# Altium schematic sheet USB_DockingSTN.SchDoc
size A3; Organization: Altium Limited; Address1: L3, 12a Rodborough Rd; Address2: Frenchs Forest; Address3: NSW; Address4: Australia 2086
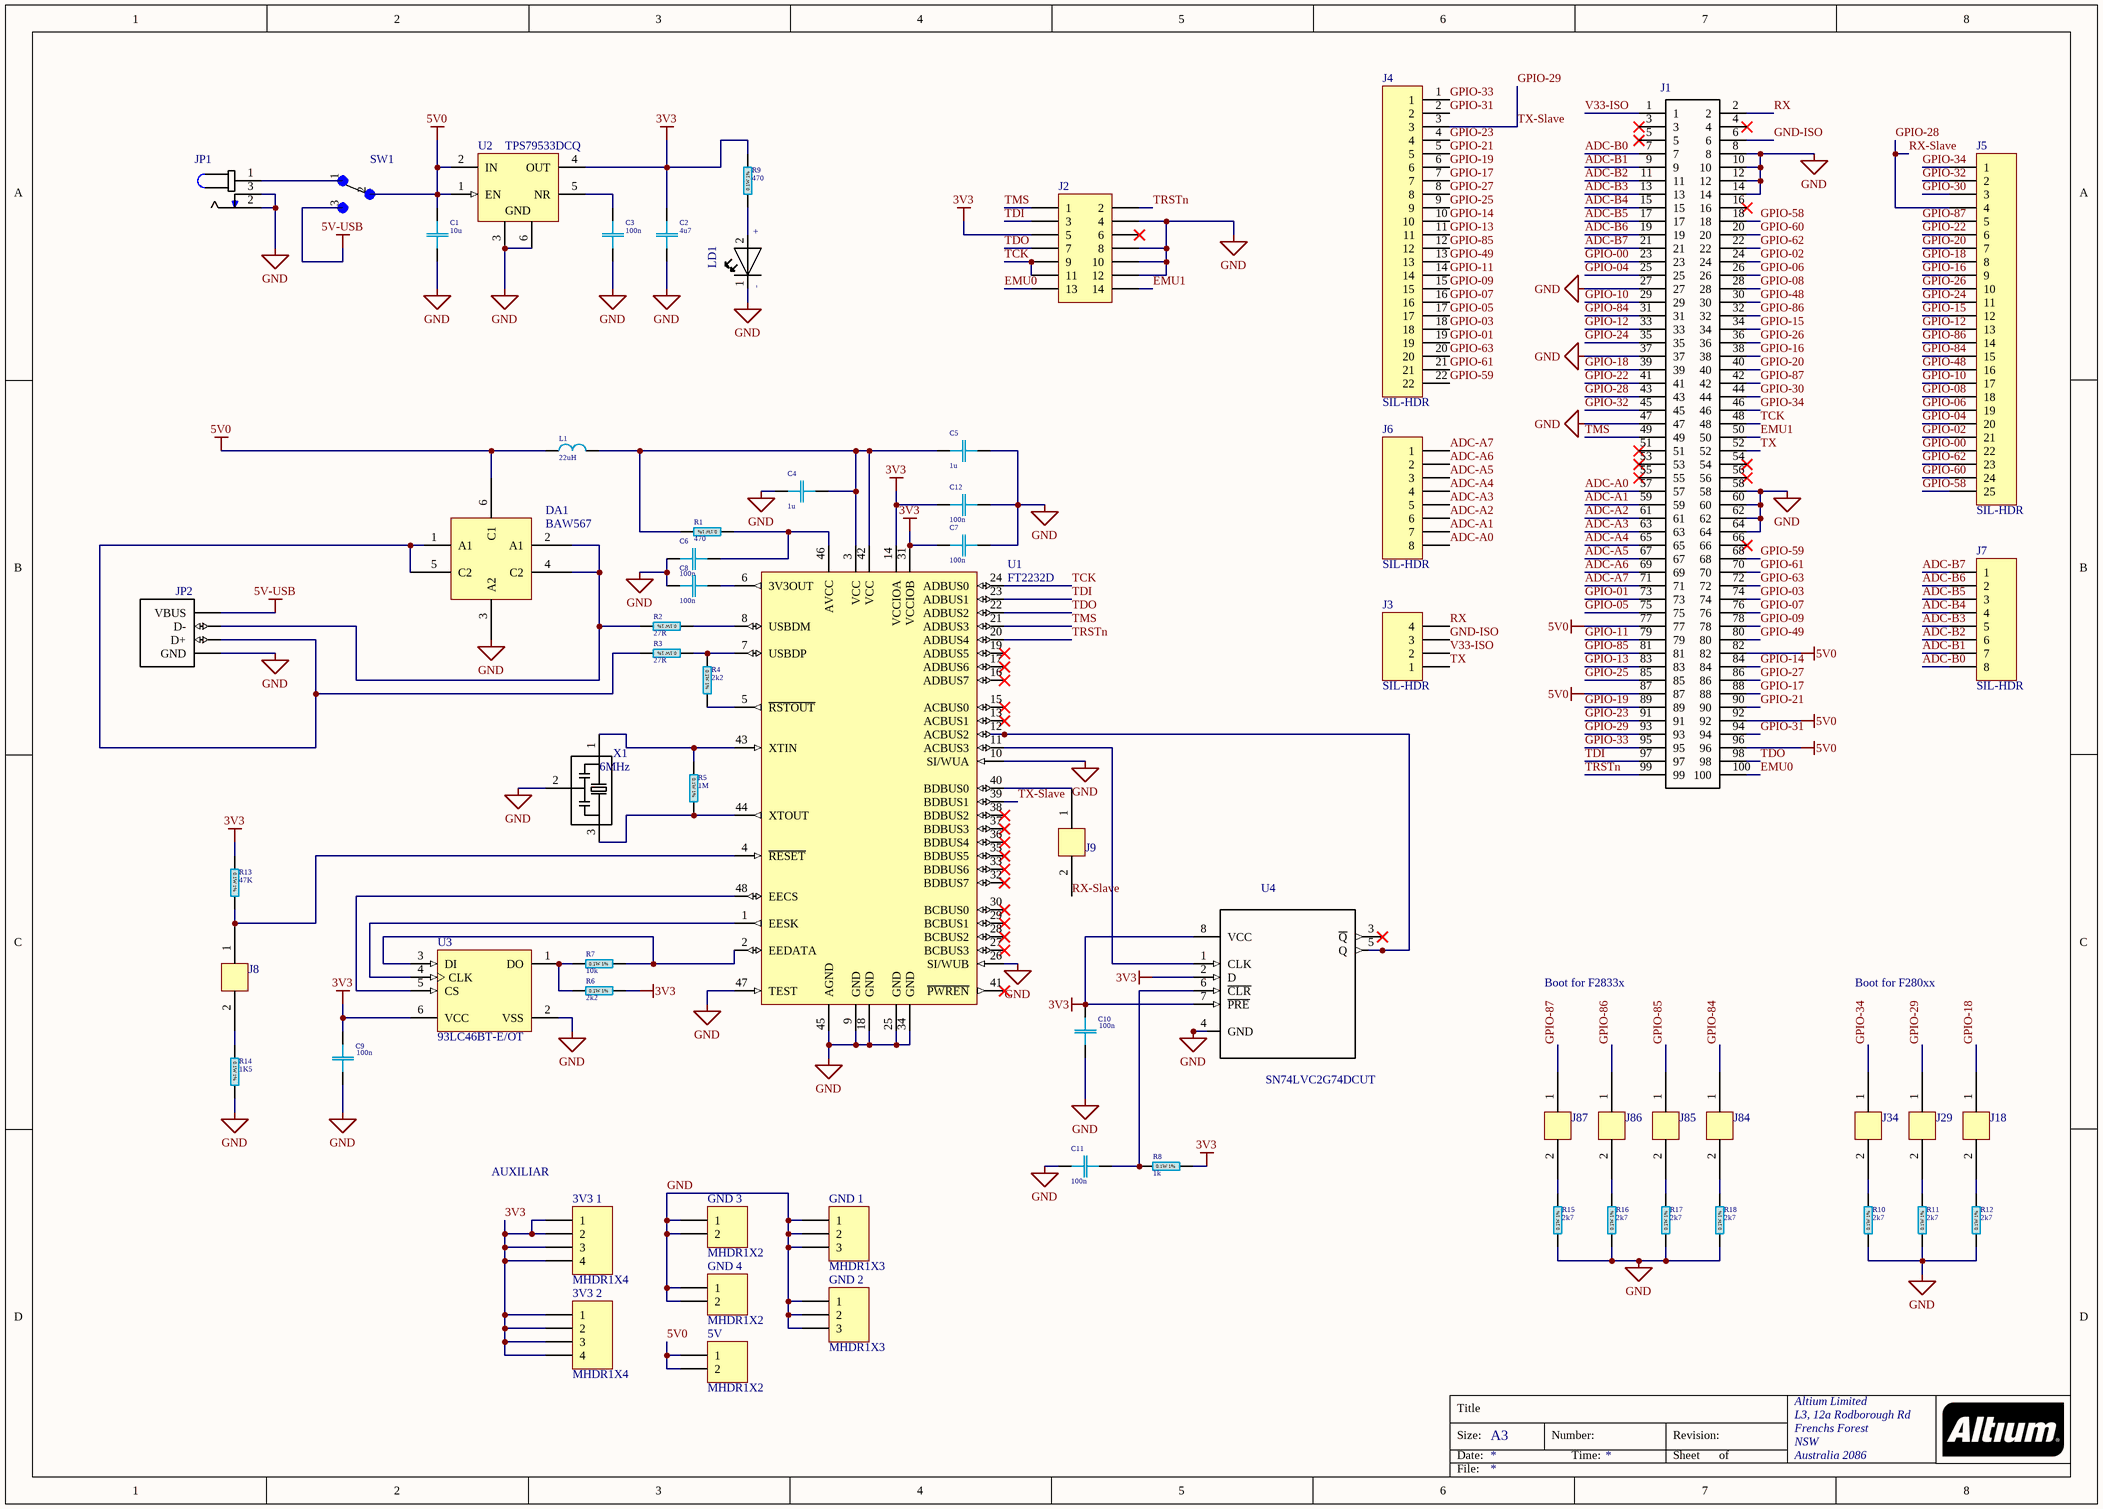
[diagram p0: USB_DockingSTN.SchDoc]

## Parts
3V3_1  MHDR1X4  [MHDR1X4]
3V3_2  MHDR1X4  [MHDR1X4]
5V  MHDR1X2  [MHDR1X2]
C1  10u  [C 0805(2012)x0.65]
C2  0n: 4u7  [C 0805(2012)x0.65]
C3  0n: 100n  [C 0805(2012)x0.65]
C4  1u  [C 0603(1608)x0.8]
C5  1u  [C 0603(1608)x0.8]
C6  100n  [C 0603(1608)x0.8]
C7  100n  [C 0603(1608)x0.8]
C8  100n  [C 0603(1608)x0.8]
C9  100n  [C 0603(1608)x0.8]
C10  100n  [C 0603(1608)x0.8]
C11  100n  [C 0603(1608)x0.8]
C12  100n  [C 0603(1608)x0.8]
DA1  BAW567  [BAW567]
GND_1  MHDR1X3  [MHDR1X3]
GND_2  MHDR1X3  [MHDR1X3]
GND_3  MHDR1X2  [MHDR1X2]
GND_4  MHDR1X2  [MHDR1X2]
J1  5390213-1  [*TE_5390213-1]  (value not drawn)
J2  MHDR2X7  [MHDR2X7]  (value not drawn)
J3  SIL-HDR  [MHDR1X4]
J4  SIL-HDR  [PIN22]
J5  SIL-HDR  [HDR1X25]
J6  SIL-HDR  [MHDR1X8]
J7  SIL-HDR  [MHDR1X8]
J8  (no value)  [PCBComponent_1]
J9  J9  [PCBComponent_1]
J18  (no value)  [PCBComponent_1]
J29  (no value)  [PCBComponent_1]
J34  (no value)  [PCBComponent_1]
J84  (no value)  [PCBComponent_1]
J85  (no value)  [PCBComponent_1]
J86  (no value)  [PCBComponent_1]
J87  (no value)  [PCBComponent_1]
JP1  PJ-002BH  [*CUI_PJ-002BH]  (value not drawn)
JP2  292304-1  [*TE_292304-1]  (value not drawn)
L1  22uH  [L 0805(2012)]
LD1  WL-SMCW  [*WL-SMCW_0603]  (value not drawn)
R1  470  [R 0603(1608)]
R2  27R  [R 0603(1608)]
R3  27R  [R 0603(1608)]
R4  2k2  [R 0603(1608)]
R5  1M  [R 0603(1608)]
R6  2k2  [R 0603(1608)]
R7  10k  [R 0603(1608)]
R8  1k  [R 0603(1608)]
R9  470  [R 0603(1608)]
R10  2k7  [R 0603(1608)]
R11  2k7  [R 0603(1608)]
R12  2k7  [R 0603(1608)]
R13  47K  [R 0603(1608)]
R14  1K5  [R 0603(1608)]
R15  2k7  [R 0603(1608)]
R16  2k7  [R 0603(1608)]
R17  2k7  [R 0603(1608)]
R18  2k7  [R 0603(1608)]
SW1  400BWMSP1R2BLKSM6QE  [*SW_400BWMSP1R2BLKSM6QE]  (value not drawn)
U1  FT2232D  [LQFP-48_N]
U2  TPS79533DCQ  [TI-DCQ6_N]
U3  93LC46BT-E/OT  [SOT-23-OT6_N]
U4  SN74LVC2G74DCUT  [*SOP50P310X90-8N]
X1  (no value)  [*OSC_CSTCR4M00G53-R0]

## Nets
3V3: 3V3_1.1 3V3_1.2 3V3_1.3 3V3_1.4 3V3_2.1 3V3_2.2 3V3_2.3 3V3_2.4 C2.1 C7.1 C9.2 C10.2 C12.1 J2.5 R6.2 R8.2 R9.2 R13.1 U1.14(VCCIOA) U1.31(VCCIOB) U2.4(OUT) U3.6(VCC) U4.2(D) U4.7(~{PRE}) U4.8(VCC)
5V0: 5V.1 5V.2 C1.1 DA1.6(C1) J1.77 J1.82 J1.87 J1.92 J1.96 L1.1 SW1.2 U2.1(EN) U2.2(IN)
5V-USB: JP2.1(VBUS) SW1.3
GND: C1.2 C2.2 C3.2 C4.1 C5.2 C6.1 C7.2 C8.1 C9.1 C10.1 C11.2 C12.2 DA1.3(A2) GND_1.1 GND_1.2 GND_1.3 GND_2.1 GND_2.2 GND_2.3 GND_3.1 GND_3.2 GND_4.1 GND_4.2 J1.8 J1.10 J1.12 J1.14 J1.27 J1.37 J1.47 J1.58 J1.60 J1.62 J1.64 J2.4 J2.8 J2.10 J2.12 JP1.2 JP1.3 JP2.4(GND) LD1.1(NEG) R10.1 R11.1 R12.1 R14.2 R15.1 R16.1 R17.1 R18.1 U1.9(GND) U1.10(SI/WUA) U1.18(GND) U1.25(GND) U1.26(SI/WUB) U1.34(GND) U1.45(AGND) U1.47(TEST) U2.3(GND) U2.6(GND) U3.2(VSS) U4.4(GND) X1.2
ADC-A0: J1.57 J6.8
ADC-A1: J1.59 J6.7
ADC-A2: J1.61 J6.6
ADC-A3: J1.63 J6.5
ADC-A4: J1.65 J6.4
ADC-A5: J1.67 J6.3
ADC-A6: J1.69 J6.2
ADC-A7: J1.71 J6.1
ADC-B0: J1.7 J7.8
ADC-B1: J1.9 J7.7
ADC-B2: J1.11 J7.6
ADC-B3: J1.13 J7.5
ADC-B4: J1.15 J7.4
ADC-B5: J1.17 J7.3
ADC-B6: J1.19 J7.2
ADC-B7: J1.21 J7.1
EMU0: J1.100 J2.13
EMU1: J1.50 J2.14
GND-ISO: J1.6 J3.3
GPIO-00: J1.23 J5.22
GPIO-01: J1.73 J4.19
GPIO-02: J1.24 J5.21
GPIO-03: J1.74 J4.18
GPIO-04: J1.25 J5.20
GPIO-05: J1.75 J4.17
GPIO-06: J1.26 J5.19
GPIO-07: J1.76 J4.16
GPIO-08: J1.28 J5.18
GPIO-09: J1.78 J4.15
GPIO-10: J1.29 J5.17
GPIO-11: J1.79 J4.14
GPIO-12: J1.33 J5.13
GPIO-13: J1.83 J4.11
GPIO-14: J1.84 J4.10
GPIO-15: J1.34 J5.12
GPIO-16: J1.38 J5.9
GPIO-17: J1.88 J4.7
GPIO-18: J1.39 J5.8 J18.1
GPIO-19: J1.89 J4.6
GPIO-20: J1.40 J5.7
GPIO-21: J1.90 J4.5
GPIO-22: J1.41 J5.6
GPIO-23: J1.91 J4.4
GPIO-24: J1.35 J5.11
GPIO-25: J1.85 J4.9
GPIO-26: J1.36 J5.10
GPIO-27: J1.86 J4.8
GPIO-28: J1.43 J5.4 J9.2  [also labelled RX-Slave]
GPIO-29: J1.93 J4.3 J29.1 U1.39(BDBUS1)  [also labelled TX-Slave]
GPIO-30: J1.44 J5.3
GPIO-31: J1.94 J4.2
GPIO-32: J1.45 J5.2
GPIO-33: J1.95 J4.1
GPIO-34: J1.46 J5.1 J34.1
GPIO-48: J1.30 J5.16
GPIO-49: J1.80 J4.13
GPIO-58: J1.18 J5.25
GPIO-59: J1.68 J4.22
GPIO-60: J1.20 J5.24
GPIO-61: J1.70 J4.21
GPIO-62: J1.22 J5.23
GPIO-63: J1.72 J4.20
GPIO-84: J1.31 J5.15 J84.1
GPIO-85: J1.81 J4.12 J85.1
GPIO-86: J1.32 J5.14 J86.1
GPIO-87: J1.42 J5.5 J87.1
RX: J1.2 J3.4
TCK: J1.48 J2.9 J2.11 U1.24(ADBUS0)
TDI: J1.97 J2.3 U1.23(ADBUS1)
TDO: J1.98 J2.7 U1.22(ADBUS2)
TMS: J1.49 J2.1 U1.21(ADBUS3)
TRSTn: J1.99 J2.2 U1.20(ADBUS4)
TX: J1.52 J3.1
V33-ISO: J1.1 J3.2
NetC3_1: C3.1 U2.5(NR)
NetC4_2: C4.2 C5.1 L1.2 R1.2 U1.3(VCC) U1.42(VCC)
NetC6_2: C6.2 R1.1 U1.46(AVCC)
NetC8_2: C8.2 U1.6(3V3OUT)
NetC11_1: C11.1 R8.1 U4.6(~{CLR})
NetDA1_1: DA1.1(A1) DA1.5(C2) JP2.3(D+) R3.2
NetDA1_2: DA1.2(A1) DA1.4(C2) JP2.2(D-) R2.2
NetJ8_1: J8.1 R13.2 U1.4(~{RESET})
NetJ8_2: J8.2 R14.1
NetJ9_1: J9.1 U1.40(BDBUS0)
NetJ18_2: J18.2 R12.2
NetJ29_2: J29.2 R11.2
NetJ34_2: J34.2 R10.2
NetJ84_2: J84.2 R18.2
NetJ85_2: J85.2 R17.2
NetJ86_2: J86.2 R16.2
NetJ87_2: J87.2 R15.2
NetJP1_1: JP1.1 SW1.1
NetLD1_2: LD1.2(POS) R9.1
NetR2_1: R2.1 U1.8(USBDM)
NetR3_1: R3.1 R4.1 U1.7(USBDP)
NetR4_2: R4.2 U1.5(~{RSTOUT})
NetR5_1: R5.1 U1.43(XTIN) X1.1
NetR5_2: R5.2 U1.44(XTOUT) X1.3
NetR6_1: R6.1 R7.1 U3.1(DO)
NetR7_2: R7.2 U1.2(EEDATA) U3.3(DI)
NetU1_1: U1.1(EESK) U3.4(CLK)
NetU1_11: U1.11(ACBUS3) U4.1(CLK)
NetU1_12: U1.12(ACBUS2) U4.5(Q)
NetU1_48: U1.48(EECS) U3.5(CS)

Not connected (* = marked no-connect by the designer): J1 3* 4* 5* 16* 51* 53* 54* 55* 56* 66*; J2 6*; U1 13(ACBUS1)* 15(ACBUS0)* 16(ADBUS7)* 17(ADBUS6)* 19(ADBUS5)* 27(BCBUS3)* 28(BCBUS2)* 29(BCBUS1)* 30(BCBUS0)* 32(BDBUS7)* 33(BDBUS6)* 35(BDBUS5)* 36(BDBUS4)* 37(BDBUS3)* 38(BDBUS2)* 41(~{PWREN})*; U4 3(~{Q})*

## Notes on the sheet
- (near X1) 6MHz
- Boot for F2833x
- Boot for F280xx
- (near 3V3_1) AUXILIAR
- Title
- Size:
- Date:
- A3
- Number:
- Time:
- Revision:
- Sheet
- of
- File:
- (in symbol R 0603-5%) 0.1W 1%
- (in symbol WL-SMCW) +; -

## Library data of the parts
3V3_1 3V3_2 J3 = MHDR1X4: Header, 4-Pin; LatestRevisionDate: 17-Jul-2002; LatestRevisionNote: Re-released for DXP Platform.; Publisher: Altium Limited
5V GND_3 GND_4 = MHDR1X2: Header, 2-Pin; LatestRevisionDate: 17-Jul-2002; LatestRevisionNote: Re-released for DXP Platform.; Publisher: Altium Limited
C1-C3 = C 0805  100V X7R - 10n: SMD-0805   100V X7R 10%; Part Number: CL21B103KCNC; Manufacturer: Samsung; TYPE: Capacitors; Package-mm: 2012; Mount Type: SMT; Publisher: Hefest; Manufacturer Alternate: *; Part Number Alternate: *; Published: 07.04.2019; Supplier 1: Comet; Supplier 2: *; Supplier 3: *; Supplier Part Number 1: C0805 10nF 100V X7R SAMSUNG; Supplier Part Number 2: *; Supplier Part Number 3: *; RoHS: Y; Technology: Ceramic  MLCC; Value 1: *; Value 2: *; Package: 0805; VDC: 100V; TempCo: X7R; Tolerance %: ±10%; VAC: *; ESR Ohm: *; ComponentLink1Description: Datasheet link; ComponentLink1URL: https://store.comet.bg/download-file.php?id=11; Temperature Range: -55°C ~ +125°C; Price: 0.031
  C1: Value: 10u
C4-C12 = C 0603    16V X7R - 1u: SMD-0603     16V X5R 10%; Manufacturer: Samsung; TYPE: Capacitors; TempCo: X7R; Package-mm: 1608; Part Number: *; Mount Type: SMT; Publisher: Hefest; Manufacturer Alternate: *; Part Number Alternate: *; Published: 07.04.2019; Supplier 1: Comet; Supplier 2: *; Supplier 3: *; Supplier Part Number 1: C0603 1.0uF 16V X7R SAMSUNG; Supplier Part Number 2: *; Supplier Part Number 3: *; RoHS: Y; Technology: Ceramic  MLCC; Value 1: *; Value 2: *; Package: 0603; VDC: 16V; VAC: *; ESR Ohm: *; ComponentLink1Description: Datasheet link; ComponentLink1URL: https://store.comet.bg/download-file.php?id=11; Temperature Range: -55°C ~ +125°C; Price: 0.056; Tolerance %: ±10%
  C4 C5: Value: 1u
  C6-C12: Value: 100n
DA1 = A1
GND_1 GND_2 = MHDR1X3: Header, 3-Pin; LatestRevisionDate: 17-Jul-2002; LatestRevisionNote: Re-released for DXP Platform.; Publisher: Altium Limited
J1 = 5390213-1: D2P,100 POS,3.3V,NB DRAM,PB-FREE; Centerline_Pitch: 1.27 mm[.05 in]; Number_of_Positions: 100; Product_Type: Socket; MF: TE Connectivity; MP: 5390213-1; TE_purchase_URL: https://www.te.com/usa-en/product-5390213-1.html?te_bu=Cor&te_type=disp&te_campaign=seda_glo_cor-seda-global-disp-prtnr-fy19-seda-model-bom-cta_sma-317_1&elqCampaignId=32493; Package: None; Price: None; SnapEDA_Link: https://www.snapeda.com/parts/5390213-1/TE%20Connectivity%20AMP%20Connectors/view-part/?ref=snap; EU_RoHS_Compliance: Compliant; Availability: Unavailable; Value: *
J2 = MHDR2X7: Header, 7-Pin, Dual row; LatestRevisionDate: 17-Jul-2002; LatestRevisionNote: Re-released for DXP Platform.; Publisher: Altium Limited
J4 = Edge Con 22: 22-Pin Edge Connector; LatestRevisionDate: 17-Jul-2002; LatestRevisionNote: Re-released for DXP Platform.; Publisher: Altium Limited
J5 = Header 25: Header, 25-Pin; LatestRevisionDate: 17-Jul-2002; LatestRevisionNote: Re-released for DXP Platform.; Publisher: Altium Limited
J6 J7 = MHDR1X8: Header, 8-Pin; LatestRevisionDate: 17-Jul-2002; LatestRevisionNote: Re-released for DXP Platform.; Publisher: Altium Limited
J8 J9 J18 J29 J34 J84-J87 = Component_1
JP1 = PJ-002BH: 2.5 x 6.5 mm, 5.0 A, Horizontal, Through Hole, Dc Power Jack Connector; MF: CUI Devices; Package: None; Digi-Key_Part_Number: CP-002BH-ND; Digi-Key_Purchase_URL: https://www.digikey.com/product-detail/en/cui-devices/PJ-002BH/CP-002BH-ND/408447?utm_source=snapeda&utm_medium=aggregator&utm_campaign=symbol; SnapEDA_Link: https://www.snapeda.com/parts/PJ-002BH/CUI%20Devices/view-part/?ref=snap; CUI_purchase_URL: https://www.cuidevices.com/product/interconnect/connectors/dc-power-connectors/jacks/pj-002bh?utm_source=snapeda.com&utm_medium=referral&utm_campaign=snapedaBOM; MP: PJ-002BH; Value: *
JP2 = 292304-1: USB - B USB 2.0 Receptacle Connector 4 Position Through Hole, Right Angle; MF: TE Connectivity; Centerline_Pitch: 2.5 mm[.098 in]; Number_of_Positions: 4; Availability: Unavailable; Price: None; EU_RoHS_Compliance: Compliant; Package: None; SnapEDA_Link: https://www.snapeda.com/parts/292304-1/TE%20Connectivity%20AMP%20Connectors/view-part/585812/?ref=snap; MP: 292304-1; Product_Type: Connector; TE_purchase_URL: https://www.te.com/usa-en/product-292304-1.html?te_bu=Cor&te_type=disp&te_campaign=seda_glo_cor-seda-global-disp-prtnr-fy19-seda-model-bom-cta_sma-317_1&elqCampaignId=32493; Value: *
L1 = L 0805 100n: SMD 0805 Q-65 @150MHz; Part Number: CCFH0805 C R10J; Manufacturer: COILS; TYPE: Inductors; Ind: 100n; Imax: 0.4A; DCR: 0.46Ω; Material: Ferrite; S.R.F.: 1200MHz; Package-mm: 2012; Tolerance %: ±5%; Q@100MHz: 65; Temperature Range: -55°C ~ +125°C; Irms: *; Isat: *; Value1: 0.46Ω; Value2: 0.4A; Technology: Chip; Published: 07.04.2019; Publisher: Hefest; Mount Type: SMT; Package: 0805; ComponentLink1Description: Datasheet link; ComponentLink1URL: https://store.comet.bg/download-file.php?id=377; RoHS: Y; Manufacturer Alternate: *; Supplier 1: Comet; Supplier Part Number 1: CL0805 100nH CCFH; Supplier 2: *; Supplier Part Number 2: *; Supplier 3: *; Supplier Part Number 3: *; Part Number Alternate: *; Price: 0.169; Value: 22uH
LD1 = WL-SMCW: LED, 0805, B GREEN, 40MCD, 570NM; Bulb Size: -; LED Colour: Green; Luminous Intens; MF: Wurth Electronics; MP: 150080VS75000; Package: 0805 WÃ¼rth Elektronik; Digi-Key_Part_Number: 732-4986-1-ND; Digi-Key_Purchase_URL: https://www.digikey.com/product-detail/en/w-rth-elektronik/150080VS75000/732-4986-1-ND/4489922?utm_source=snapeda&utm_medium=aggregator&utm_campaign=symbol; SnapEDA_Link: https://www.snapeda.com/parts/150080VS75000/Wurth%20Electronics%20Inc./view-part/?ref=snap; Value: *
R1-R18 = R 0603-5%: SMD 0603 0.1W     5%   75V; Manufacturer: YAGEO; TempCo: ±100ppm/°C; Package-mm: 1608; Value Code: 102; Part Number: *; Mount Type: SMT; Publisher: Hefest; Manufacturer Alternate: *; Published: 07.04.2019; Supplier 1: Comet; Supplier 2: *; Supplier 3: *; Supplier Part Number 1: R0603 1.0K 5% YAG/ASJ; Supplier Part Number 2: *; Supplier Part Number 3: *; RoHS: Y; Technology: Thick film; Value 2: *; Package: 0603; VDC: 75V; Tolerance %: ±5%; ComponentLink1Description: Datasheet link; ComponentLink1URL: https://store.comet.bg/download-file.php?id=140; Temperature Range: -55°C ~ +155°C; Price: 0.016; Part Number Alternate: *; TYPE: Resistor; Value 1: *; Power: 0.1W
  R1 R9: Value: 470
  R2 R3: Value: 27R
  R4 R6: Value: 2k2
  R5: Value: 1M
  R7: Value: 10k
  R8: Value: 1k
  R10-R12 R15-R18: Value: 2k7
  R13: Value: 47K
  R14: Value: 1K5
SW1 = 400BWMSP1R2BLKSM6QE: 400B Series 3 A SPDT On-None-On Surface Mount Sub-Miniature Rocker Switch; MF: E-Switch; Package: None; Availability: Unavailable; Price: None; SnapEDA_Link: https://www.snapeda.com/parts/400BWMSP1R2BLKSM6QE/E-Switch/view-part/?ref=snap; MP: 400BWMSP1R2BLKSM6QE; Value: *
U1 = FT2232D: FT2232D Dual USB to Serial UART/FIFO IC, -40 to +85 degC, 48-pin LQFP; Manufacturer: FTDI; DatasheetVersion: ver 2.05, Apr-2011; PackageVersion: Apr-11; PackageReference: LQFP-48; PackageDescription: 48-Pin Thin Quad Flat Pack, 7 x 7 mm Body, 0.5 mm Pitch; PartNumber: FT2232D; ComponentLink1Description: Manufacturer URL; ComponentLink1URL: http://www.ftdichip.com/; ComponentLink2Description: Datasheet; ComponentLink2URL: http://www.ftdichip.com/Support/Documents/DataSheets/ICs/DS_FT2232D.pdf
U2 = TPS79533DCQ: Single Output High PSRR LDO, 500 mA, Fixed 3.3 V Output, 2.7 to 5.5 V Input, 6-pin SOT-223 (DCQ), Green (RoHS & no Sb/Br); Manufacturer: Texas Instruments; Accuracy(%): 2; Fixed Output Options(V): 3.3; Iout(Max)(A): 0.5; Iq(Typ)(mA): 0.26; Rating: Catalog; SubFamily: Single Channel LDO; Vdo(Typ)(mV): 105; Vin(Max)(V): 5.5; Vin(Min)(V): 2.7; DatasheetVersion: SLVS350H; PackageVersion: 4202109/D; PackageReference: DCQ6; PackageDescription: 6-Pin Plastic Small Outline, Body 3.5 x 6.5 mm, Pitch 1.27 mm; Supplier 1: Digi-Key; Supplier Part Number 1: 296-27106-5-ND; Supplier 2: Farnell; Supplier Part Number 2: 1702824; Supplier 3: Newark; Supplier Part Number 3: 72K9601; Supplier 4: Mouser; Supplier Part Number 4: 595-TPS79533DCQ; Eco-Plan: Green (RoHS & no Sb/Br); Vout Adj(Max)(V): 3.3; Vout Adj(Min)(V): 3.3; Mounting Technology: Surface Mount; PartNumber: TPS79533DCQ; ComponentLink1Description: Manufacturer URL; ComponentLink1URL: http://www.ti.com/; ComponentLink2Description: Datasheet; ComponentLink2URL: http://www.ti.com/general/docs/lit/getliterature.tsp?genericPartNumber=TPS79533&fileType=pdf; ComponentLink3Description: Package Specification; ComponentLink3URL: http://www.ti.com/litv/pdf/mpds098c
U3 = 93LC46BT-E/OT: 1K, 64x16-bit, 2.5V Microwire Serial EEPROM, 6-Pin SOT-23, Extended Temperature, Tape and Reel; Manufacturer: Microchip; DatasheetVersion: revG, May-2008; PackageVersion: revBB, Aug-2009; PackageReference: SOT-23-OT6; PackageDescription: 6-Lead Plastic Small Outline Transistor (OT) [SOT-23]; Supplier 1: Digi-Key; Supplier Part Number 1: 93LC46BT-E/OT-ND; Supplier 2: Mouser; Supplier Part Number 2: 579-93LC46BT-E/OT; Mounting Technology: Surface Mount; Code_IPC: SOT26A-6; PartNumber: 93LC46BT-E/OT; ComponentLink1Description: Manufacturer URL; ComponentLink1URL: http://www.microchip.com/; ComponentLink2Description: Datasheet; ComponentLink2URL: http://ww1.microchip.com/downloads/en/DeviceDoc/21749G.pdf; ComponentLink3Description: Package Specification; ComponentLink3URL: http://www.microchip.com/stellent/groups/techpub_sg/documents/packagingspec/en012702.pdf
U4 = SN74LVC2G74DCUT: Single Positive-Edge-Triggered D-Type Flip-Flop with Clear and Preset 8-VSSOP -40 to 125; MF: Texas Instruments; Digi-Key_Part_Number: 296-26623-1-ND; SnapEDA_Link: https://www.snapeda.com/parts/SN74LVC2G74DCUT/Texas%20Instruments/view-part/?ref=snap; Package: VFSOP-8 Texas Instruments; MP: SN74LVC2G74DCUT; Digi-Key_Purchase_URL: https://www.digikey.com/product-detail/en/texas-instruments/SN74LVC2G74DCUT/296-26623-1-ND/2255081?utm_source=snapeda&utm_medium=aggregator&utm_campaign=symbol; Value: *
X1 = CSTCR4M00G53-R0: Ceramic Resonator 4MHz ??0.5% _Tol_ ??0.2% _Stability_ 15pF 60Ohm 3-Pin CSMD T/R; MF: Murata; MP: CSTCR4M00G53-R0; Package: SMD-3 Murata; Price: None; SnapEDA_Link: https://www.snapeda.com/parts/CSTCR4M00G53-R0/Murata%20Electronics%20North%20America/view-part/?ref=snap; Availability: Unavailable; Value: *